# Altium schematic sheet Ethernet.SchDoc
size A3
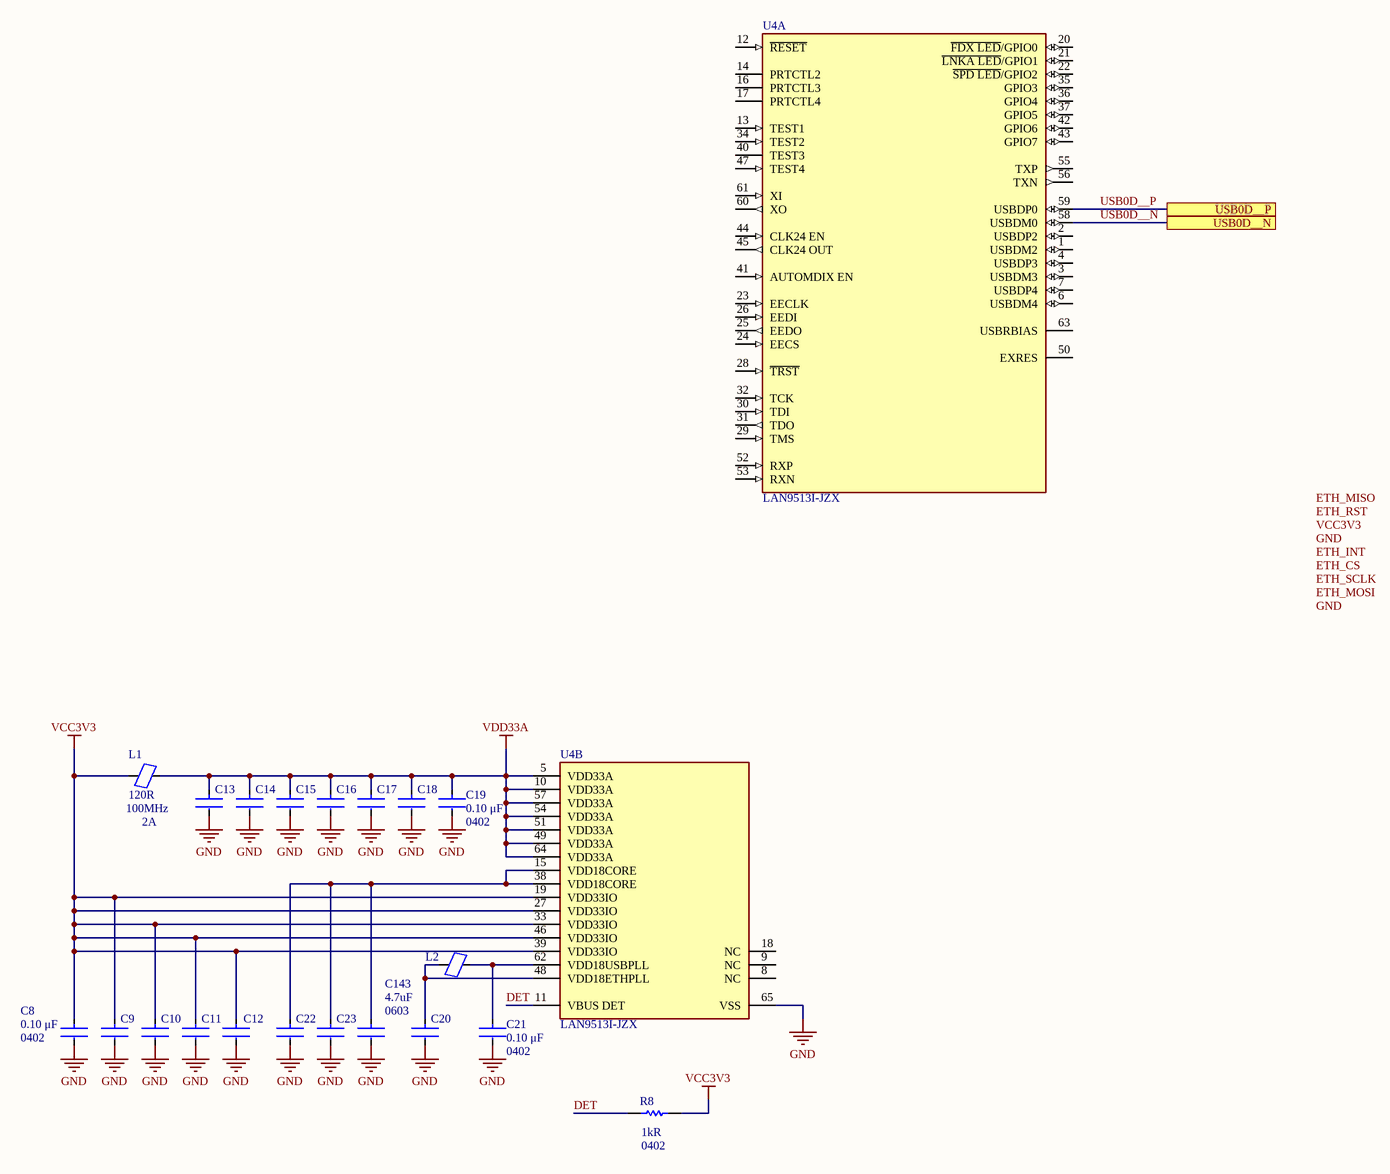
[diagram p0: Ethernet.SchDoc]

## Parts
C8  Capacitance: 0.10 μF  Case/Package: 0402  [FP-C0402-BB-MFG]  (hidden comment: C0402C104K8PACTU)
C9  C0402C104K8PACTU  [FP-C0402-BB-MFG]  (value not drawn)
C10  C0402C104K8PACTU  [FP-C0402-BB-MFG]  (value not drawn)
C11  C0402C104K8PACTU  [FP-C0402-BB-MFG]  (value not drawn)
C12  C0402C104K8PACTU  [FP-C0402-BB-MFG]  (value not drawn)
C13  C0402C104K8PACTU  [FP-C0402-BB-MFG]  (value not drawn)
C14  C0402C104K8PACTU  [FP-C0402-BB-MFG]  (value not drawn)
C15  C0402C104K8PACTU  [FP-C0402-BB-MFG]  (value not drawn)
C16  C0402C104K8PACTU  [FP-C0402-BB-MFG]  (value not drawn)
C17  C0402C104K8PACTU  [FP-C0402-BB-MFG]  (value not drawn)
C18  C0402C104K8PACTU  [FP-C0402-BB-MFG]  (value not drawn)
C19  value 0.10 μF  Case Code (Imperial): 0402  [FP-C0402-BB-MFG]  (hidden comment: C0402C104K8PACTU)
C20  C0402C104K8PACTU  [FP-C0402-BB-MFG]  (value not drawn)
C21  value 0.10 μF  Case Code (Imperial): 0402  [FP-C0402-BB-MFG]  (hidden comment: C0402C104K8PACTU)
C22  C0402C104K8PACTU  [FP-C0402-BB-MFG]  (value not drawn)
C23  C0402C104K8PACTU  [FP-C0402-BB-MFG]  (value not drawn)
C143  value 4.7uF  Case/Package: 0603  [FP-C0603-CG-MFG]  (hidden comment: C0603C475K9PACTU)
L1  Impedance: 120R  Max DC Current: 2A  Test Frequency: 100MHz  [CAP0402i]  (hidden comment: FB_120@100MHz)
L2  FB_120@100MHz  [CAP0402i]  (value not drawn)
R8  value 1kR  Case\/Package: 0402  [RESC1005X40X25NL05T05]  (hidden comment: ERJ-2RKF1001X)
U4  LAN9513I-JZX  [FP-LAN9513I-JZX-MFG]  (parts A,B of 2)

## Ports
USB0D__N, USB0D__P

## Nets
GND: C8.2 C9.2 C10.2 C11.2 C12.2 C13.2 C14.2 C15.2 C16.2 C17.2 C18.2 C19.2 C20.2 C21.2 C22.2 C23.2 C143.2 U4.65(VSS)
VCC3V3: C8.1 C9.1 C10.1 C11.1 C12.1 L1.1 R8.2 U4.19(VDD33IO) U4.27(VDD33IO) U4.33(VDD33IO) U4.39(VDD33IO) U4.46(VDD33IO)
VDD33A: C13.1 C14.1 C15.1 C16.1 C17.1 C18.1 C19.1 L1.2 U4.5(VDD33A) U4.10(VDD33A) U4.49(VDD33A) U4.51(VDD33A) U4.54(VDD33A) U4.57(VDD33A) U4.64(VDD33A)
DET: R8.1 U4.11(VBUS_DET)
USB0D__N: U4.58(USBDM0) ; port USB0D__N
USB0D__P: U4.59(USBDP0) ; port USB0D__P
NetC20_1: C20.1 L2.1 U4.48(VDD18ETHPLL)
NetC21_1: C21.1 L2.2 U4.62(VDD18USBPLL)
NetC22_1: C22.1 C23.1 C143.1 U4.15(VDD18CORE) U4.38(VDD18CORE)

Not connected (* = marked no-connect by the designer): U4 1(USBDM2) 2(USBDP2) 3(USBDM3) 4(USBDP3) 6(USBDM4) 7(USBDP4) 8(NC) 9(NC) 12(~{RESET}) 13(TEST1) 14(PRTCTL2) 16(PRTCTL3) 17(PRTCTL4) 18(NC) 20(~{FDX_LED}/GPIO0) 21(~{LNKA_LED}/GPIO1) 22(~{SPD_LED}/GPIO2) 23(EECLK) 24(EECS) 25(EEDO) 26(EEDI) 28(~{TRST}) 29(TMS) 30(TDI) 31(TDO) 32(TCK) 34(TEST2) 35(GPIO3) 36(GPIO4) 37(GPIO5) 40(TEST3) 41(AUTOMDIX_EN) 42(GPIO6) 43(GPIO7) 44(CLK24_EN) 45(CLK24_OUT) 47(TEST4) 50(EXRES) 52(RXP) 53(RXN) 55(TXP) 56(TXN) 60(XO) 61(XI) 63(USBRBIAS)

## Notes on the sheet
- Labels drawn without touching a wire or pin: ETH_CS, ETH_INT, ETH_MISO, ETH_MOSI, ETH_RST, ETH_SCLK, GND, VCC3V3

## Library data of the parts
C8 = CMP-2008-02046-2: CAP CER 0.1UF 10V X5R 0402; Manufacturer: Kemet; Material: Ceramic; Temperature Coefficient: 15%; Tolerance: 0.1; Value: 0.10 μF; Dissipation Factor: 5%; Package: C0402-BB; Temperature: -55°C to +125°C; ComponentLink2Description: Datasheet; Temperature Characteristic: X5R; Device Class L1: Passive Components; Height: 0.55mm; Lead Free: Yes; ComponentLink2URL: https://content.kemet.com/datasheets/KEM_C1002_X7R_SMD.pdf; Device Class L2: Capacitors; Temperature Range Low: -55°C; Temperature Range High: +125°C; RoHS: TRUE; Octopart: https://octopart.com/c0402c104k8pactu-kemet-140039; Automotive: No; Mouser Description: Capacitor 100 nF 10 VDC 0402; Category: Cap; Voltage Rating: 10 V; Digikey Description: CAP CER 0.1UF 10V X5R 0402; Ipc Land Pattern Name: CAPC10050X50; Device Class L3: Ceramic Capacitors; Manufacturer Part Number: C0402C104K8PACTU; Supplier 1: Arrow Electronics; Supplier Part Number 1: C0402C104K8PACTU; Stock 1: 669298; Pricing 1: 1=0.0497, 10=0.0165, 25=0.0164, 100=0.0066, 250=0.0065, 1000=0.0064, 3000=0.0063, 15000=0.0062, 30000=0.0059, 75000=0.0057 (USD); Mounting Technology: Surface Mount,PCB; Pins: 2; Case Code (Metric): 1005; Case Code (Imperial): 0402; Dielectric Material: Ceramic; Min Operating Temperature: -55°C; Max Operating Temperature: 85°C; Packaging: Tape and Reel; Dielectric: X5R; Series: SMD Comm X5R; Voltage: 10V; Voltage Rating (DC): 10V; Package Quantity: 10000; Termination: SMD/SMT; Construction: Flat; Length: 1mm; Width: 0.5mm; Depth: 0.5mm; Lead Pitch: 0.3mm; Radiation Hardening: No; RoHS Compliant: Yes; Reach SVHC Compliant: No
C9-C18 C20 C22 C23 = CMP-2008-02046-2: CAP CER 0.1UF 10V X5R 0402; Manufacturer: Kemet; Material: Ceramic; Capacitance: 0.10 μF; Temperature Coefficient: 15%; Tolerance: 0.1; Value: 0.10 μF; Dissipation Factor: 5%; Package: C0402-BB; Temperature: -55°C to +125°C; ComponentLink2Description: Datasheet; Temperature Characteristic: X5R; Device Class L1: Passive Components; Height: 0.55mm; Lead Free: Yes; ComponentLink2URL: https://content.kemet.com/datasheets/KEM_C1002_X7R_SMD.pdf; Device Class L2: Capacitors; Temperature Range Low: -55°C; Temperature Range High: +125°C; RoHS: TRUE; Octopart: https://octopart.com/c0402c104k8pactu-kemet-140039; Automotive: No; Mouser Description: Capacitor 100 nF 10 VDC 0402; Category: Cap; Voltage Rating: 10 V; Digikey Description: CAP CER 0.1UF 10V X5R 0402; Ipc Land Pattern Name: CAPC10050X50; Device Class L3: Ceramic Capacitors; Manufacturer Part Number: C0402C104K8PACTU; Supplier 1: Arrow Electronics; Supplier Part Number 1: C0402C104K8PACTU; Stock 1: 669298; Pricing 1: 1=0.0497, 10=0.0165, 25=0.0164, 100=0.0066, 250=0.0065, 1000=0.0064, 3000=0.0063, 15000=0.0062, 30000=0.0059, 75000=0.0057 (USD); Mounting Technology: Surface Mount,PCB; Case/Package: 0402; Pins: 2; Case Code (Metric): 1005; Case Code (Imperial): 0402; Dielectric Material: Ceramic; Min Operating Temperature: -55°C; Max Operating Temperature: 85°C; Packaging: Tape and Reel; Dielectric: X5R; Series: SMD Comm X5R; Voltage: 10V; Voltage Rating (DC): 10V; Package Quantity: 10000; Termination: SMD/SMT; Construction: Flat; Length: 1mm; Width: 0.5mm; Depth: 0.5mm; Lead Pitch: 0.3mm; Radiation Hardening: No; RoHS Compliant: Yes; Reach SVHC Compliant: No
C19 C21 = CMP-2008-02046-2: CAP CER 0.1UF 10V X5R 0402; Manufacturer: Kemet; Material: Ceramic; Temperature Coefficient: 15%; Tolerance: 0.1; Dissipation Factor: 5%; Package: C0402-BB; Temperature: -55°C to +125°C; ComponentLink2Description: Datasheet; Capacitance: 0.10 μF; Temperature Characteristic: X5R; Device Class L1: Passive Components; Height: 0.55mm; Lead Free: Yes; ComponentLink2URL: https://content.kemet.com/datasheets/KEM_C1002_X7R_SMD.pdf; Device Class L2: Capacitors; Temperature Range Low: -55°C; Temperature Range High: +125°C; RoHS: TRUE; Octopart: https://octopart.com/c0402c104k8pactu-kemet-140039; Automotive: No; Mouser Description: Capacitor 100 nF 10 VDC 0402; Category: Cap; Voltage Rating: 10 V; Digikey Description: CAP CER 0.1UF 10V X5R 0402; Ipc Land Pattern Name: CAPC10050X50; Device Class L3: Ceramic Capacitors; Manufacturer Part Number: C0402C104K8PACTU; Supplier 1: Arrow Electronics; Supplier Part Number 1: C0402C104K8PACTU; Stock 1: 669298; Pricing 1: 1=0.0497, 10=0.0165, 25=0.0164, 100=0.0066, 250=0.0065, 1000=0.0064, 3000=0.0063, 15000=0.0062, 30000=0.0059, 75000=0.0057 (USD); Mounting Technology: Surface Mount,PCB; Case/Package: 0402; Pins: 2; Case Code (Metric): 1005; Dielectric Material: Ceramic; Min Operating Temperature: -55°C; Max Operating Temperature: 85°C; Packaging: Tape and Reel; Dielectric: X5R; Series: SMD Comm X5R; Voltage: 10V; Voltage Rating (DC): 10V; Package Quantity: 10000; Termination: SMD/SMT; Construction: Flat; Length: 1mm; Width: 0.5mm; Depth: 0.5mm; Lead Pitch: 0.3mm; Radiation Hardening: No; RoHS Compliant: Yes; Reach SVHC Compliant: No
C143 = CMP-2006-02256-2: CAP CER 4.7UF 6.3V X5R 0603; Manufacturer: Kemet; Temperature Coefficient: 15%; Tolerance: 10%; Material: Ceramic; Dissipation Factor: 5%; Device Class L3: Ceramic Capacitors; RoHS: TRUE; Lead Free: Yes; ComponentLink2Description: Datasheet; Mouser Description: Multilayer Ceramic Capacitors MLCC - SMD/SMT 6.3volts 4.7uF X5R 10%; Package: C0603-CG; Digikey Description: CAP CER 4.7UF 6.3V X5R 0603; ComponentLink2URL: https://content.kemet.com/datasheets/KEM_C1006_X5R_SMD.pdf; Category: Cap; Temperature Range Low: -55°C; Capacitance: 4.7uF; Temperature: -55°C to +85°C; Octopart: https://octopart.com/c0603c475k9pactu-kemet-104242; Ipc Land Pattern Name: CAPC16080X80; Voltage Rating: 6.3V; Temperature Range High: +85°C; Height: 0.9mm; Temperature Characteristic: X5R; Device Class L1: Passive Components; Manufacturer Part Number: C0603C475K9PACTU; Automotive: No; Device Class L2: Capacitors; Supplier 1: Arrow Electronics; Supplier Part Number 1: C0603C475K9PACTU; Stock 1: 711537; Pricing 1: 4000=0.0263, 8000=0.0232, 16000=0.0229, 24000=0.0227 (USD); Mounting Technology: Surface Mount,PCB; Pins: 2; Case Code (Metric): 1608; Case Code (Imperial): 0603; Dielectric Material: Ceramic; Contact Plating: Tin,Matte; Min Operating Temperature: -55°C; Max Operating Temperature: 85°C; Package Quantity: 4000; Packaging: Tape and Reel; Voltage Rating (DC): 6.3V; Dielectric: X5R; Series: SMD Comm X5R; Termination: SMD/SMT; Voltage: 6.3V; Construction: Flat; Length: 1.6mm; Width: 0.8mm; Depth: 0.8mm; Lead Pitch: 0.7mm; Radiation Hardening: No; Reach SVHC Compliant: No; RoHS Compliant: Yes
L1 = Ferrite Bead_ 0402_120R_100MHz_2A: Ferrite Beads Multi-Layer 120Ohm 25% 100MHz 2A 0.055Ohm DCR 0402 T/R; Manufacturer 1: Murata; Manufacturer Part Number 1: BLM15PX121SN1D; Material: Steel; Number of Lines: 1; DC Resistance (DCR): 55mR; RoHS: Yes; Category: Inductors; Stock 1: 80000; Pricing 1: 10000=0.02260, 20000=0.02070, 30000=0.02030, 50000=0.02000 (USD); Case/Package: 0402; Number of Pins: 2; Case Code (Metric): 1005; Case Code (Imperial): 0402; Weight: 2.3E-05oz; Min Operating Temperature: -55°C; Max Operating Temperature: 125°C; Package Quantity: 10000; Tolerance: 25%; Packaging: Tape and Reel; Current Rating: 2A; Max Current Rating: 2A; Termination: SMD/SMT; Number of Circuits: 1; Series: EMIFIL®, BLM15P; Length: 1mm; Width: 0.5mm; Height: 0.5mm; REACH SVHC: No SVHC; Lead Free: Lead Free; RoHS Compliant: Yes; ComponentLink1URL: https://datasheet.ciiva.com/41449/001172210-da-01-en-drossel-0402-120r-1-0x0-5mm-10000st-41449498.pdf?src-supplier=Conrad; ComponentLink1Description: https://datasheet.ciiva.com/41449/001172210-da-01-en-drossel-0402-120r-1-0x0-5mm-10000st-41449498.pdf?src-supplier=Conrad; ComponentLink2URL: https://datasheet.ciiva.com/41860/l0110e-41860699.pdf?src-supplier=Digi-Key; ComponentLink2Description: https://datasheet.ciiva.com/41860/l0110e-41860699.pdf?src-supplier=Digi-Key; ComponentLink3URL: https://datasheet.ciiva.com/29364/l0110e-29364069.pdf?src-supplier=Digi-Key; ComponentLink3Description: https://datasheet.ciiva.com/29364/l0110e-29364069.pdf?src-supplier=Digi-Key; Stock 2: 723874; Pricing 2: 1=0.10000, 10=0.05600, 50=0.05600, 100=0.03800, 500=0.03200, 1000=0.02700, 2500=0.02600, 5000=0.02400, 10000=0.02300, 20000=0.02100 (USD); Stock 3: 1310967; Pricing 3: 1=0.10000, 10=0.08400, 25=0.07560, 50=0.05540, 100=0.04790, 250=0.03780, 500=0.03192, 1000=0.02688, 5000=0.02394 (USD); Part Number: BLM15PX121SN1D; Supplier 1: Mouser; Supplier 2: Digi-Key; Supplier 3: Arrow Electronics; Supplier Part Number 1: 81-BLM15PX121SN1D; Supplier Part Number 2: 490-9656-1-ND; Supplier Part Number 3: BLM15PX121SN1D; Component Type: Generic
L2 = Ferrite Bead_ 0402_120R_100MHz_2A: Ferrite Beads Multi-Layer 120Ohm 25% 100MHz 2A 0.055Ohm DCR 0402 T/R; Manufacturer 1: Murata; Manufacturer Part Number 1: BLM15PX121SN1D; Material: Steel; Impedance: 120R; Number of Lines: 1; DC Resistance (DCR): 55mR; RoHS: Yes; Category: Inductors; Stock 1: 80000; Pricing 1: 10000=0.02260, 20000=0.02070, 30000=0.02030, 50000=0.02000 (USD); Case/Package: 0402; Number of Pins: 2; Case Code (Metric): 1005; Case Code (Imperial): 0402; Weight: 2.3E-05oz; Min Operating Temperature: -55°C; Max Operating Temperature: 125°C; Package Quantity: 10000; Tolerance: 25%; Packaging: Tape and Reel; Current Rating: 2A; Max Current Rating: 2A; Termination: SMD/SMT; Max DC Current: 2A; Test Frequency: 100MHz; Number of Circuits: 1; Series: EMIFIL®, BLM15P; Length: 1mm; Width: 0.5mm; Height: 0.5mm; REACH SVHC: No SVHC; Lead Free: Lead Free; RoHS Compliant: Yes; ComponentLink1URL: https://datasheet.ciiva.com/41449/001172210-da-01-en-drossel-0402-120r-1-0x0-5mm-10000st-41449498.pdf?src-supplier=Conrad; ComponentLink1Description: https://datasheet.ciiva.com/41449/001172210-da-01-en-drossel-0402-120r-1-0x0-5mm-10000st-41449498.pdf?src-supplier=Conrad; ComponentLink2URL: https://datasheet.ciiva.com/41860/l0110e-41860699.pdf?src-supplier=Digi-Key; ComponentLink2Description: https://datasheet.ciiva.com/41860/l0110e-41860699.pdf?src-supplier=Digi-Key; ComponentLink3URL: https://datasheet.ciiva.com/29364/l0110e-29364069.pdf?src-supplier=Digi-Key; ComponentLink3Description: https://datasheet.ciiva.com/29364/l0110e-29364069.pdf?src-supplier=Digi-Key; Stock 2: 723874; Pricing 2: 1=0.10000, 10=0.05600, 50=0.05600, 100=0.03800, 500=0.03200, 1000=0.02700, 2500=0.02600, 5000=0.02400, 10000=0.02300, 20000=0.02100 (USD); Stock 3: 1310967; Pricing 3: 1=0.10000, 10=0.08400, 25=0.07560, 50=0.05540, 100=0.04790, 250=0.03780, 500=0.03192, 1000=0.02688, 5000=0.02394 (USD); Part Number: BLM15PX121SN1D; Supplier 1: Mouser; Supplier 2: Digi-Key; Supplier 3: Arrow Electronics; Supplier Part Number 1: 81-BLM15PX121SN1D; Supplier Part Number 2: 490-9656-1-ND; Supplier Part Number 3: BLM15PX121SN1D; Component Type: Generic
R8 = CMP-1011-00510-4: Chip Resistor, 1 KOhm, +/- 1%, 100 mW, -55 to 155 degC, 0402 (1005 Metric), RoHS, Tape and Reel; Manufacturer: Basic Passives; Voltage Rating: 50 V; Resistance: 1 KOhm; Power Rating: 100 mW; Temperature Coefficient: 100ppm/°C; Max Power Dissipation: 100mW; Voltage Rating (DC): 50V; PartNumber: ERJ-2RKF1001X; DatasheetVersion: 04/2015; Radiation Hardening: No; Pins: 2; Height: 0.35 mm; RoHSCompliant: true; Case Code (Imperial): 0402; ComponentLink2Description: Datasheet; ComponentLink1Description: Manufacturer URL; PackageReference: 0402; Mount: Surface Mount; Package Quantity: 10000; Tolerance: 1%; ComponentLink1URL: http://www.panasonic.com/; PackageDescription: 2-Pin Surface Mount Device, Body 1 x 0.5 mm; Mounting Technology: Surface Mount; Case Code (Metric): 1005; ComponentLink2URL: http://industrial.panasonic.com/cdbs/www-data/pdf/RDA0000/AOA0000C86.pdf; REACH SVHC: Yes; Packaging: Tape and Reel; Max Operating Temperature: 155 degC; Min Operating Temperature: -55 degC; Width: 0.5 mm; Length: 1 mm; Supplier 1: Mouser; Supplier Part Number 1: 667-ERJ-2RKF1001X; Manufacturer Part Number: ERJ-2RKF1001X; RoHS: Yes; Category: Chip SMD Resistors; Stock 1: 6226220; Pricing 1: 1=0.1, 10=0.018, 50=0.018, 100=0.008, 1000=0.006, 10000=0.004 (USD); Case/Package: 0402; Contact Plating: Tin; Termination: SMD/SMT; Resistor Type: Thick Film; Number of Terminations: 2; Series: ERJ; Resistance Tolerance: 1%; Features: Automotive AEC-Q200; Technology: THICK FILM; Construction: Rectangular; Depth: 0.5mm; Reach SVHC Compliant: Yes; RoHS Compliant: Yes; Lead Free: Lead Free; Military Standard: Not
U4 = CMP-06298-000015-1: IC USB 2.0 ETHER CTRLR 64QFN; Max Supply Voltage: 3.6V; Data Rate: 100Mbps; Supply Voltage-Nom: 3.3V; Min Supply Voltage: 3V; Max Power Dissipation: 857W; Contact Plating: Tin; Series: -; Number of Pins: 64; Lead Free: Lead Free; Package Quantity: 260; Max Operating Temperature: 85°C; Radiation Hardening: No; Operating Supply Voltage: 3.3V; Min Operating Temperature: -40°C; Interface: USB; Packaging: Tray; Mount: Surface Mount; Case/Package: QFN